# Altium schematic sheet CameraConnector.SchDoc
size A
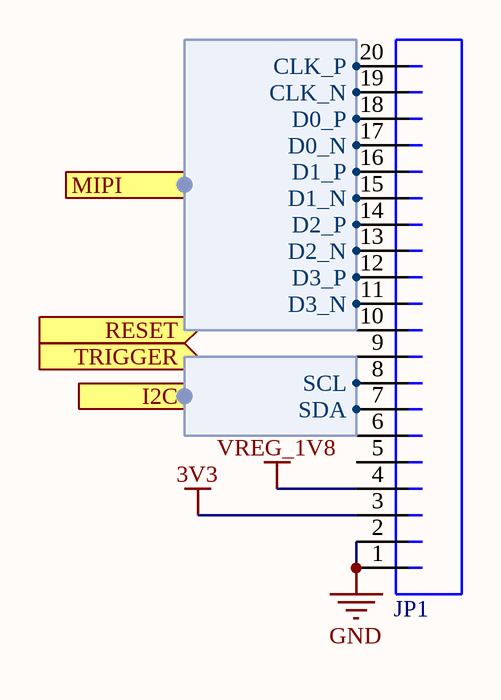
[diagram p0: CameraConnector.SchDoc]

## Parts
JP1  JST_JMD_20_HORZ  [JST-JMD-20-SMD-HORZ]  (value not drawn)

## Ports
I2C (harness I2C), MIPI (harness MIPI), RESET (in), TRIGGER (in)

## Harnesses
I2C: SCL, SDA
MIPI: CLK_P, CLK_N, D0_P, D0_N, D1_P, D1_N, D2_P, D3_N, D2_N, D3_P

## Nets
3V3: JP1.3
GND: JP1.1 JP1.2
VREG_1V8: JP1.4
RESET: JP1.10 ; port RESET
TRIGGER: JP1.9 ; port TRIGGER
NetJP1_7: JP1.7 ; port I2C.SDA
NetJP1_8: JP1.8 ; port I2C.SCL
NetJP1_11: JP1.11 ; port MIPI.D3_N
NetJP1_12: JP1.12 ; port MIPI.D3_P
NetJP1_13: JP1.13 ; port MIPI.D2_N
NetJP1_14: JP1.14 ; port MIPI.D2_P
NetJP1_15: JP1.15 ; port MIPI.D1_N
NetJP1_16: JP1.16 ; port MIPI.D1_P
NetJP1_17: JP1.17 ; port MIPI.D0_N
NetJP1_18: JP1.18 ; port MIPI.D0_P
NetJP1_19: JP1.19 ; port MIPI.CLK_N
NetJP1_20: JP1.20 ; port MIPI.CLK_P

Not connected (* = marked no-connect by the designer): JP1 5 6

## Library data of the parts
JP1 = JST_JMD_20_HORZ: Manufacturer: JST Sales America, Inc.; PartNumber: 20PS-JMDSS-G-1-TF; PackageReference: JMD-20; Mounting Technology: Surface Mount